# Altium schematic sheet UBX_NORA_B1_SCHEM_0006_Accessories.SchDoc
size A3; Date: 7/24/2020; CompanyName: U-blox; DrawnBy: EMOO; Engineer: EMOO; Organization: U-blox; Address1: 3950 Fairview Industrial Dr SE #100; Address2: Salem, OR 97302; Revision: A; SheetNumber: 6; SheetTotal: 6; SheetSize: B; SheetTitle: Accessories
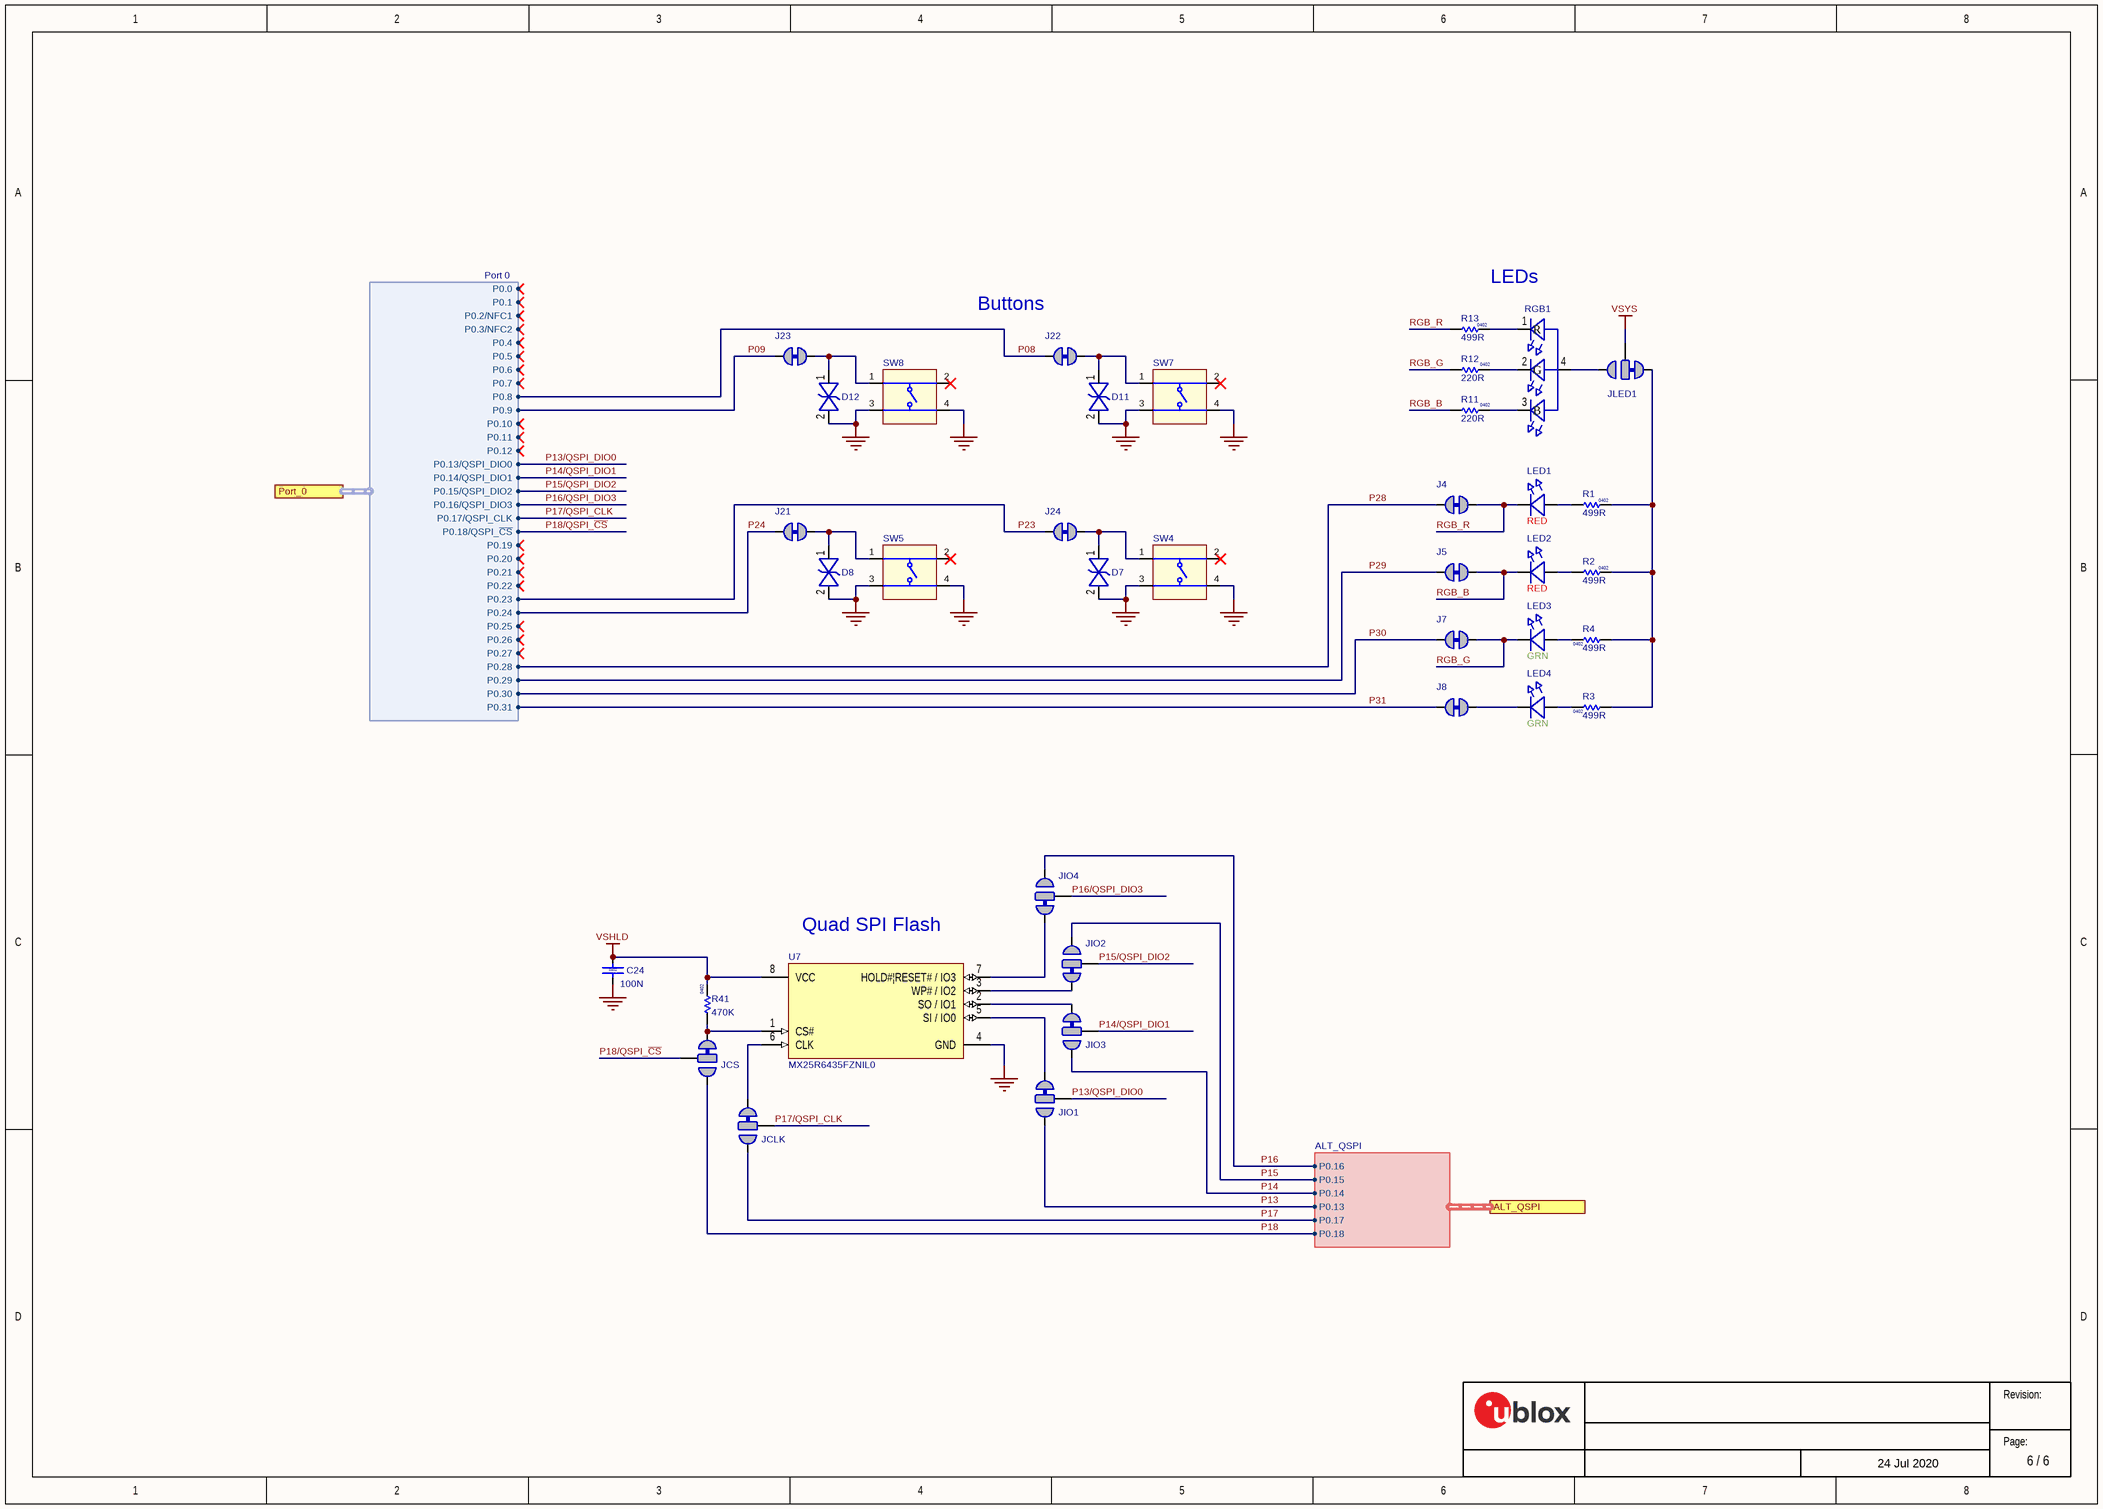
[diagram p0: UBX_NORA_B1_SCHEM_0006_Accessories.SchDoc]

## Parts
C24  value 100N  Size: 0402  [Cap 0402 HD]
D7  (no value)  [SOD-923]
D8  (no value)  [SOD-923]
D11  (no value)  [SOD-923]
D12  (no value)  [SOD-923]
J4  (no value)  [Solderbridge-Short]  (net tie, no BOM)
J5  (no value)  [Solderbridge-Short]  (net tie, no BOM)
J7  (no value)  [Solderbridge-Short]  (net tie, no BOM)
J8  (no value)  [Solderbridge-Short]  (net tie, no BOM)
J21  (no value)  [Solderbridge-Short]  (net tie, no BOM)
J22  (no value)  [Solderbridge-Short]  (net tie, no BOM)
J23  (no value)  [Solderbridge-Short]  (net tie, no BOM)
J24  (no value)  [Solderbridge-Short]  (net tie, no BOM)
JCLK  (no value)  [Solderbridge-Option]  (net tie, no BOM)
JCS  (no value)  [Solderbridge-Option]  (net tie, no BOM)
JIO1  (no value)  [Solderbridge-Option]  (net tie, no BOM)
JIO2  (no value)  [Solderbridge-Option]  (net tie, no BOM)
JIO3  (no value)  [Solderbridge-Option]  (net tie, no BOM)
JIO4  (no value)  [Solderbridge-Option]  (net tie, no BOM)
JLED1  (no value)  [Solderbridge-Option]  (net tie, no BOM)
LED1  Color: RED  [LED_0603_RED]
LED2  Color: RED  [LED_0603_RED]
LED3  Color: GRN  [LED_0603_GREEN]
LED4  Color: GRN  [LED_0603_GREEN]
R1  value 499R  Size: 0402  [RES 0402 HD]
R2  value 499R  Size: 0402  [RES 0402 HD]
R3  value 499R  Size: 0402  [RES 0402 HD]
R4  value 499R  Size: 0402  [RES 0402 HD]
R11  value 220R  Size: 0402  [RES 0402 HD]
R12  value 220R  Size: 0402  [RES 0402 HD]
R13  value 499R  Size: 0402  [RES 0402 HD]
R41  value 470K  Size: 0402  [RES 0402 HD]
RGB1  (no value)  [LED_0606_RGB_4PIN]
SW4  (no value)  [SW_TACT_SMT_6mm]
SW5  (no value)  [SW_TACT_SMT_6mm]
SW7  (no value)  [SW_TACT_SMT_6mm]
SW8  (no value)  [SW_TACT_SMT_6mm]
U7  Manufacturer P/N: MX25R6435FZNIL0  [WSON1.27P-8Pin_W-Pad]

## Ports
ALT_QSPI (harness ALT_QSPI), Port_0 (harness Port 0)

## Harnesses
Port 0: P0.4, P0.5, P0.6, P0.7, P0.8, P0.9, P0.10, P0.11, P0.12, P0.19, P0.20, P0.21, P0.22, P0.23, P0.24, P0.25, P0.26, P0.27, P0.28, P0.29, P0.30, P0.31, P0.3/NFC2, P0.2/NFC1, P0.13/QSPI_DIO0, P0.14/QSPI_DIO1, P0.15/QSPI_DIO2, P0.16/QSPI_DIO3, P0.18/QSPI_~{CS}, P0.17/QSPI_CLK, P0.0, P0.1
ALT_QSPI: P0.13, P0.14, P0.15, P0.16, P0.17, P0.18

## Nets
GND: C24.2 D7.2 D8.2 D11.2 D12.2 SW4.3 SW4.4 SW5.3 SW5.4 SW7.3 SW7.4 SW8.3 SW8.4 U7.4(GND)
VSHLD: C24.1 R41.2 U7.8(VCC)
VSYS: JLED1.2
P08: J22.2 ; port Port_0.P0.8
P09: J23.2 ; port Port_0.P0.9
P13: JIO1.3 ; port ALT_QSPI.P0.13
P13/QSPI_DIO0: JIO1.2 ; port Port_0.P0.13/QSPI_DIO0
P14: JIO3.3 ; port ALT_QSPI.P0.14
P14/QSPI_DIO1: JIO3.2 ; port Port_0.P0.14/QSPI_DIO1
P15: JIO2.3 ; port ALT_QSPI.P0.15
P15/QSPI_DIO2: JIO2.2 ; port Port_0.P0.15/QSPI_DIO2
P16: JIO4.3 ; port ALT_QSPI.P0.16
P16/QSPI_DIO3: JIO4.2 ; port Port_0.P0.16/QSPI_DIO3
P17: JCLK.3 ; port ALT_QSPI.P0.17
P17/QSPI_CLK: JCLK.2 ; port Port_0.P0.17/QSPI_CLK
P18: JCS.3 ; port ALT_QSPI.P0.18
P18/QSPI_~{CS}: JCS.2 ; port Port_0.P0.18/QSPI_~{CS}
P23: J24.2 ; port Port_0.P0.23
P24: J21.2 ; port Port_0.P0.24
P28: J4.2 ; port Port_0.P0.28
P29: J5.2 ; port Port_0.P0.29
P30: J7.2 ; port Port_0.P0.30
P31: J8.2 ; port Port_0.P0.31
RGB_B: J5.1 LED2.1(C) R11.1
RGB_G: J7.1 LED3.1(C) R12.1
RGB_R: J4.1 LED1.1(C) R13.1
NetD7_1: D7.1 J24.1 SW4.1
NetD8_1: D8.1 J21.1 SW5.1
NetD11_1: D11.1 J22.1 SW7.1
NetD12_1: D12.1 J23.1 SW8.1
NetJ8_1: J8.1 LED4.1(C)
NetJCLK_1: JCLK.1 U7.6(CLK)
NetJCS_1: JCS.1 R41.1 U7.1(CS#)
NetJIO1_1: JIO1.1 U7.5(SI_/_IO0)
NetJIO2_1: JIO2.1 U7.3(WP#_/_IO2)
NetJIO3_1: JIO3.1 U7.2(SO_/_IO1)
NetJIO4_1: JIO4.1 U7.7(HOLD#|RESET#_/_IO3)
NetJLED1_1: JLED1.1 R1.2 R2.2 R3.1 R4.1
NetJLED1_3: JLED1.3 RGB1.4(A)
NetLED1_2: LED1.2(A) R1.1
NetLED2_2: LED2.2(A) R2.1
NetLED3_2: LED3.2(A) R4.2
NetLED4_2: LED4.2(A) R3.2
NetR11_2: R11.2 RGB1.3(B)
NetR12_2: R12.2 RGB1.2(G)
NetR13_2: R13.2 RGB1.1(R)

Not connected (* = marked no-connect by the designer): SW4 2*; SW5 2*; SW7 2*; SW8 2*

## Notes on the sheet
- (near J22) Buttons
- LEDs
- (near U7) Quad SPI Flash
- 24 Jul 2020
- Revision:
- Page:

## Library data of the parts
C24 = UBXH01-2021002: CAP CER X5R 0402 100N 10% 10V; Manufacturer: Murata Manufacturing Company, Ltd.; Manufacturer P/N: GRM155R61A104KA01; Editor: roland.rust; Env: GREEN; Permitted Use: Volume Products; Perferred: PREF; Mfg P/N Status: NRND; Mfg P/N Split: 100; Mfg P/N Released: Yes; Part Number: UBXH01-2021002; Tolerance: 10%; Max Voltage: 10V; Part Type: Capacitor; Released by: roland.rust; Release Data: 2005-07-22T13:59:44; UBX Wiki: https://wiki.u-blox.com/bin/view/Operations/PartDetails?index=5759; RefDes: C; Manufacturer 2: Samsung Electro-Mechanics; Manufacturer P/N 2: CL05A104KP5NNN; Mfg P/N Status 2: Active; Mfg P/N Split 2: 0; Mfg P/N Released 2: Yes; Mfg P/N Datasheet 2: https://wiki.u-blox.com/bin/view/Generic/Docs/DocumentSummary?index=28113
D7 D8 D11 D12 = UBXH07-0000034: ESD PROTECTION DIODE ULTRA LOW LEAKAGE SOD923 ON SEMI 3V3; Manufacturer: ON Semiconductor; Manufacturer P/N: ESD9R3.3ST5G; Editor: pierpaolo.arban; Released by: dario.antonaz; Env: ROHS; Permitted Use: Support Products; Perferred: PREF; Mfg P/N Status: Active; Mfg P/N Split: 100; Mfg P/N Released: Yes; Part Number: UBXH07-0000034; Value: 3V3; Part Type: Diode; Release Data: 2015-04-23T14:51:11; UBX Wiki: https://wiki.u-blox.com/bin/view/Operations/PartDetails?index=22447; RefDes: D; Mfg P/N Datasheet: https://wiki.u-blox.com/bin/view/Generic/Docs/DocumentSummary?index=22449
J4 J5 J7 J8 J21-J24 = UBXH00-0000084: SOLDERBRIDGE-SHORT; Editor: aneeb.sohail; Env: GREEN; Permitted Use: Volume Products; Perferred: PREF; Part Number: UBXH00-0000084; Min Operating Temp: -55°C; Max Operating Temp: 155°C; Part Type: Connector; UBX Wiki: https://wiki.u-blox.com/bin/view/Operations/PartDetails?index=36363; RefDes: J
JCLK JCS JIO1-JIO4 JLED1 = UBXH00-0000083: SOLDERBRIDGE-OPTION; Editor: aneeb.sohail; Env: GREEN; Permitted Use: Volume Products; Perferred: PREF; Part Number: UBXH00-0000083; Min Operating Temp: -55°C; Max Operating Temp: 155°C; Part Type: Connector; UBX Wiki: https://wiki.u-blox.com/bin/view/Operations/PartDetails?index=36362; RefDes: J
LED1 LED2 = UBXH11-0000000: LED SMD 0603 ULTRABRIGHT LITE-ON LTST-C190KRKT RED 30mA; Manufacturer: Lite-on Technology Corporation; Editor: massimo.vlacci; Released by: sandro.sestan; Env: ROHS; Permitted Use: Support Products; Mfg P/N Status: Active; Mfg P/N Split: 100; Mfg P/N Released: Yes; Part Number: UBXH11-0000000; Value: RED; Max Current: 30mA; Size: 0603; Part Type: LED; Release Data: 2009-12-03T15:33:11; UBX Wiki: https://wiki.u-blox.com/bin/view/Operations/PartDetails?index=7900; Perferred: N/A; RefDes: DS; Manufacturer P/N: LTST-C190KRKT; Mfg P/N Datasheet: https://wiki.u-blox.com/bin/view/Generic/Docs/DocumentSummary?index=16221
LED3 LED4 = UBXH11-0000001: LED SMD 0603 GREEN 2.5V 20mA; Manufacturer: Kingbright; Manufacturer P/N: APT1608SGC; Editor: gianni.falleroni; Released by: alex.claville; Env: ROHS; Permitted Use: Support Products; Mfg P/N Status: Active; Mfg P/N Split: 50; Mfg P/N Released: Yes; Part Number: UBXH11-0000001; Value: GREEN; Max Voltage: 2.5V; Max Current: 20mA; Size: 0603; Part Type: LED; Release Data: 2022-09-27T14:26:54; UBX Wiki: https://wiki.u-blox.com/bin/view/Operations/PartDetails?index=7902; Perferred: N/A; RefDes: DS; Mfg P/N Datasheet: https://wiki.u-blox.com/bin/view/Generic/Docs/DocumentSummary?index=37527; Manufacturer 2: Lite-on Technology Corporation; Manufacturer P/N 2: LTST-C190KGKT; Mfg P/N Status 2: Active; Mfg P/N Split 2: 50; Mfg P/N Released 2: Yes; Mfg P/N Datasheet 2: https://wiki.u-blox.com/bin/view/Generic/Docs/DocumentSummary?index=16220
R1-R4 R13 = UBXH18-0000269: RES THICK FILM CHIP 0402 499R 1% 100mW; Manufacturer: KOA; Manufacturer P/N: RK73H1ETTP4990F; Editor: pierpaolo.arban; Env: ROHS; Permitted Use: Volume Products; Perferred: PREF; Mfg P/N Status: Active; Mfg P/N Split: 100; Mfg P/N Released: No; Part Number: UBXH18-0000269; Tolerance: 1%; Max Power: 100mW; Min Operating Temp: -55°C; Max Operating Temp: 125°C; Part Type: Resistor; UBX Wiki: https://wiki.u-blox.com/bin/view/Operations/PartDetails?index=25384; RefDes: R; Mfg P/N Datasheet: https://wiki.u-blox.com/bin/view/Generic/Docs/DocumentSummary?index=8222
R11 R12 = UBXH18-0008033: RES THICK FILM CHIP 0402 220R 5% 100mW; Manufacturer: ROHM; Manufacturer P/N: MCR01MZPJ221; Editor: roland.rust; Env: ROHS; Permitted Use: Volume Products; Perferred: PREF; Mfg P/N Status: Active; Mfg P/N Split: 100; Mfg P/N Released: Yes; Part Number: UBXH18-0008033; Tolerance: 5%; Max Power: 100mW; Part Type: Resistor; Released by: roland.rust; Release Data: 2009-04-24T14:36:39; UBX Wiki: https://wiki.u-blox.com/bin/view/Operations/PartDetails?index=6914; RefDes: R; Manufacturer 2: KOA; Manufacturer P/N 2: RK73B1ETTP221J; Mfg P/N Status 2: Active; Mfg P/N Split 2: 0; Mfg P/N Released 2: Yes; Manufacturer 3: YAGEO; Manufacturer P/N 3: 2322_705_87221_L; Mfg P/N Status 3: NRND; Mfg P/N Split 3: 0; Mfg P/N Released 3: Yes
R41 = UBXH18-0008113: RES THICK FILM CHIP 0402 470K 5% 100mW; Manufacturer: KOA; Manufacturer P/N: RK73B1ETTD474J; Editor: martin.frauchiger; Env: ROHS; Permitted Use: Volume Products; Perferred: PREF; Mfg P/N Status: NRND; Mfg P/N Split: 100; Mfg P/N Released: Yes; Part Number: UBXH18-0008113; Tolerance: 5%; Max Power: 100mW; Part Type: Resistor; Released by: martin.frauchiger; Release Data: 2005-08-19T10:42:45; UBX Wiki: https://wiki.u-blox.com/bin/view/Operations/PartDetails?index=7042; RefDes: R; Manufacturer 2: YAGEO; Manufacturer P/N 2: 2322_705_87474_L; Mfg P/N Status 2: Obsolete; Mfg P/N Split 2: 0; Mfg P/N Released 2: Yes
RGB1 = UBXH11-0000058: LED SMD RGB 0606 COMMON ANODE LITE-ON LTST-C19HE1WT 5V 20mA; Manufacturer: Lite-on Technology Corporation; Editor: eric.moog; Env: ROHS; Permitted Use: Support Products; Mfg P/N Status: Active; Mfg P/N Split: 100; Mfg P/N Released: No; Color: *; Part Number: UBXH11-0000058; Value: LTST-C19HE1WT; Max Voltage: 5V; Max Current: 20mA; Min Operating Temp: -15°C; Max Operating Temp: 70°C; Part Type: LED; UBX Wiki: https://wiki.u-blox.com/bin/view/Operations/PartDetails?index=38590; Perferred: N/A; RefDes: DS; Manufacturer P/N: LTST-C19HE1WT; Mfg P/N Datasheet: https://wiki.u-blox.com/bin/view/Generic/Docs/DocumentSummary?index=38664
SW4 SW5 SW7 SW8 = UBXH19-0000035: TACTILE SWITCH SPST SINGLE SMD; Manufacturer P/N: PTS645SM43SMTR92LFS; Manufacturer: C&K; Value: PTS645SM43SMTR92LFS; Editor: enric.suchanek; Released by: charlotte.biber; Env: ROHS; Permitted Use: Internal Use; Perferred: PREF; Mfg P/N Status: Active; Mfg P/N Split: 100; Mfg P/N Released: No; Part Number: UBXH19-0000035; Min Operating Temp: -40°C; Max Operating Temp: 85°C; Part Type: Switch; Release Data: 2021-08-24T16:41:59; UBX Wiki: https://wiki.u-blox.com/bin/view/Operations/PartDetails?index=32051; RefDes: S; Mfg P/N Datasheet: https://wiki.u-blox.com/bin/view/Generic/Docs/DocumentSummary?index=32053
U7 = UBXH13-0000138: MACRONIX MX25R6435FZNIL0 64MBIT SERIAL QUAD I/O SPI FLASH MEMORY 1.65 - 3.6V 8-WDFN 6X5MM; Manufacturer: Macronix International Co.,Ltd.; Editor: eric.moog; Env: ROHS; Permitted Use: Support Products; Perferred: PREF; Mfg P/N Status: Active; Mfg P/N Split: 100; Mfg P/N Released: No; Part Number: UBXH13-0000138; Value: MX25R6435FZNIL0; Min Operating Temp: -40°C; Max Operating Temp: 85°C; Part Type: Memory; UBX Wiki: https://wiki.u-blox.com/bin/view/Operations/PartDetails?index=38927; RefDes: U; Mfg P/N Datasheet: https://wiki.u-blox.com/bin/view/Generic/Docs/DocumentSummary?index=38929